# Altium project UZ_D_Voltage_3V3_5V.PrjPCB (part 2 of 2)
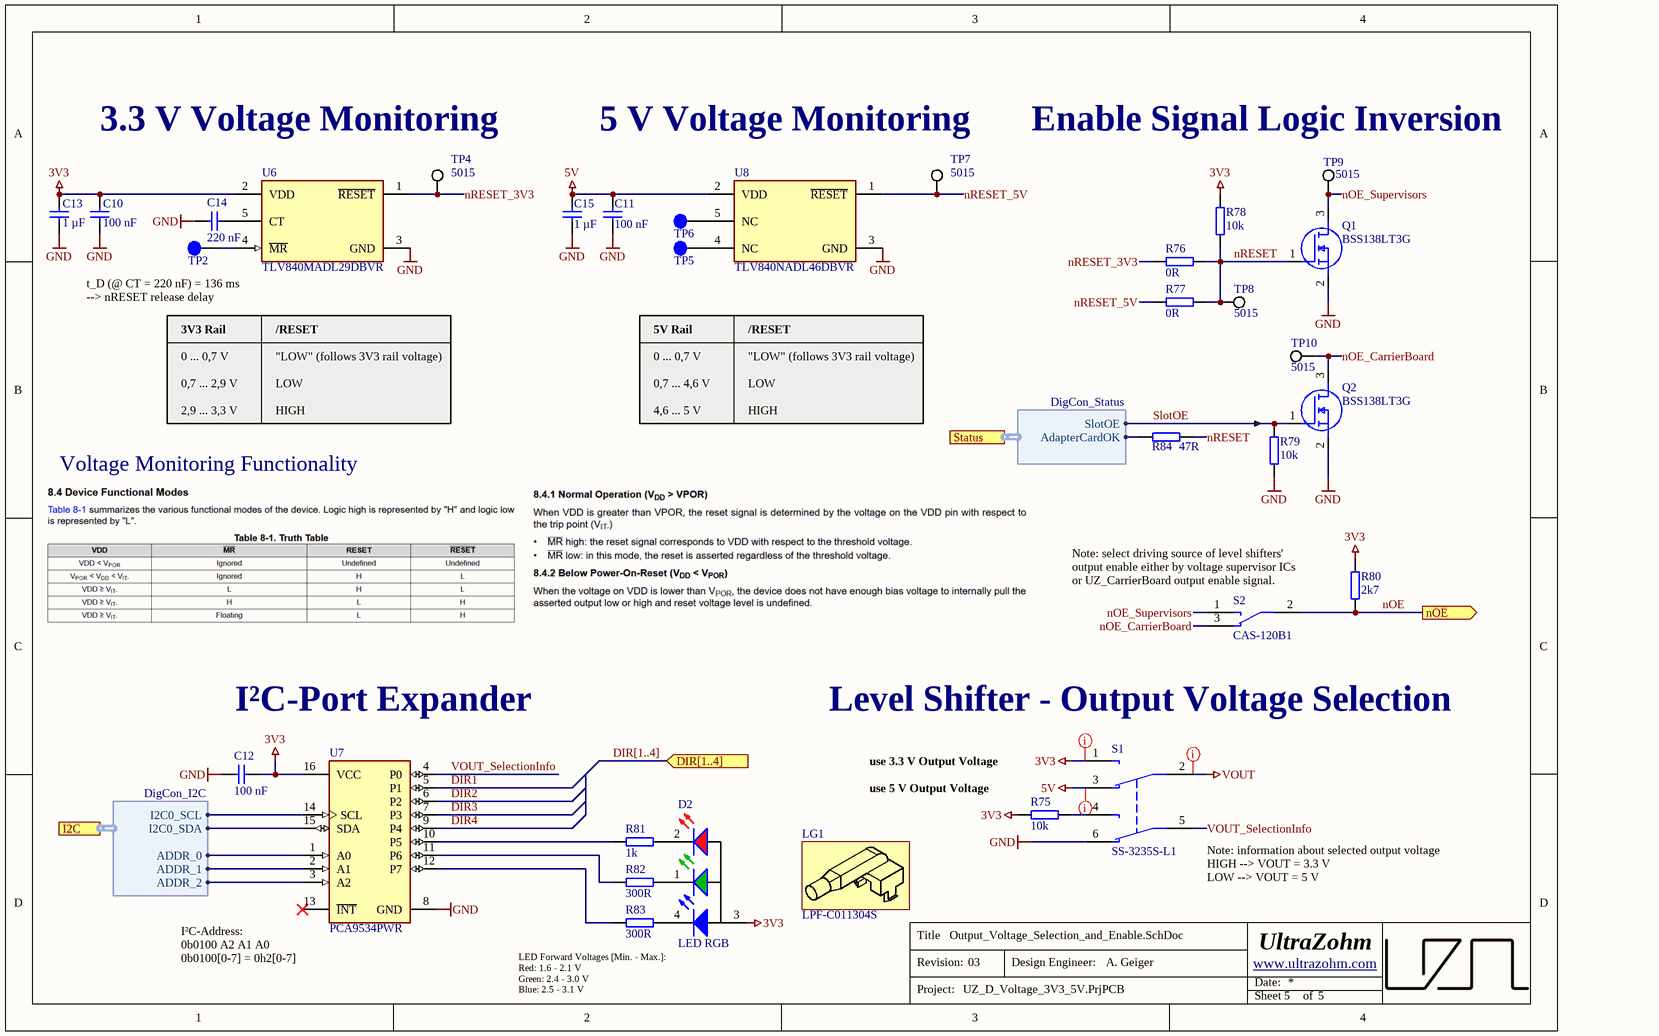
[diagram p5: Output_Voltage_Selection_and_Enable.SchDoc]

## Assembly variants
10k_pulldown_IOs: not fitted R1
100k_pulldown_IOs: not fitted R1; alternate parts R42 -> UZgen_R_0603_100k, R73 -> UZgen_R_0603_100k, R74 -> UZgen_R_0603_100k, R85 -> UZgen_R_0603_100k, R86 -> UZgen_R_0603_100k, R88 -> UZgen_R_0603_100k, R87 -> UZgen_R_0603_100k, R89 -> UZgen_R_0603_100k, R90 -> UZgen_R_0603_100k, R91 -> UZgen_R_0603_100k, R93 -> UZgen_R_0603_100k, R92 -> UZgen_R_0603_100k, R94 -> UZgen_R_0603_100k, R95 -> UZgen_R_0603_100k, R96 -> UZgen_R_0603_100k, R98 -> UZgen_R_0603_100k, R97 -> UZgen_R_0603_100k, R99 -> UZgen_R_0603_100k, R100 -> UZgen_R_0603_100k, R101 -> UZgen_R_0603_100k, R102 -> UZgen_R_0603_100k, R103 -> UZgen_R_0603_100k, R104 -> UZgen_R_0603_100k, R105 -> UZgen_R_0603_100k, R106 -> UZgen_R_0603_100k, R107 -> UZgen_R_0603_100k, R108 -> UZgen_R_0603_100k, R109 -> UZgen_R_0603_100k, R110 -> UZgen_R_0603_100k, R111 -> UZgen_R_0603_100k